# Altium schematic sheet Arduino_Mega2560.SchDoc
size A4; DocumentNumber: 1; SheetNumber: 1; SheetTotal: 4
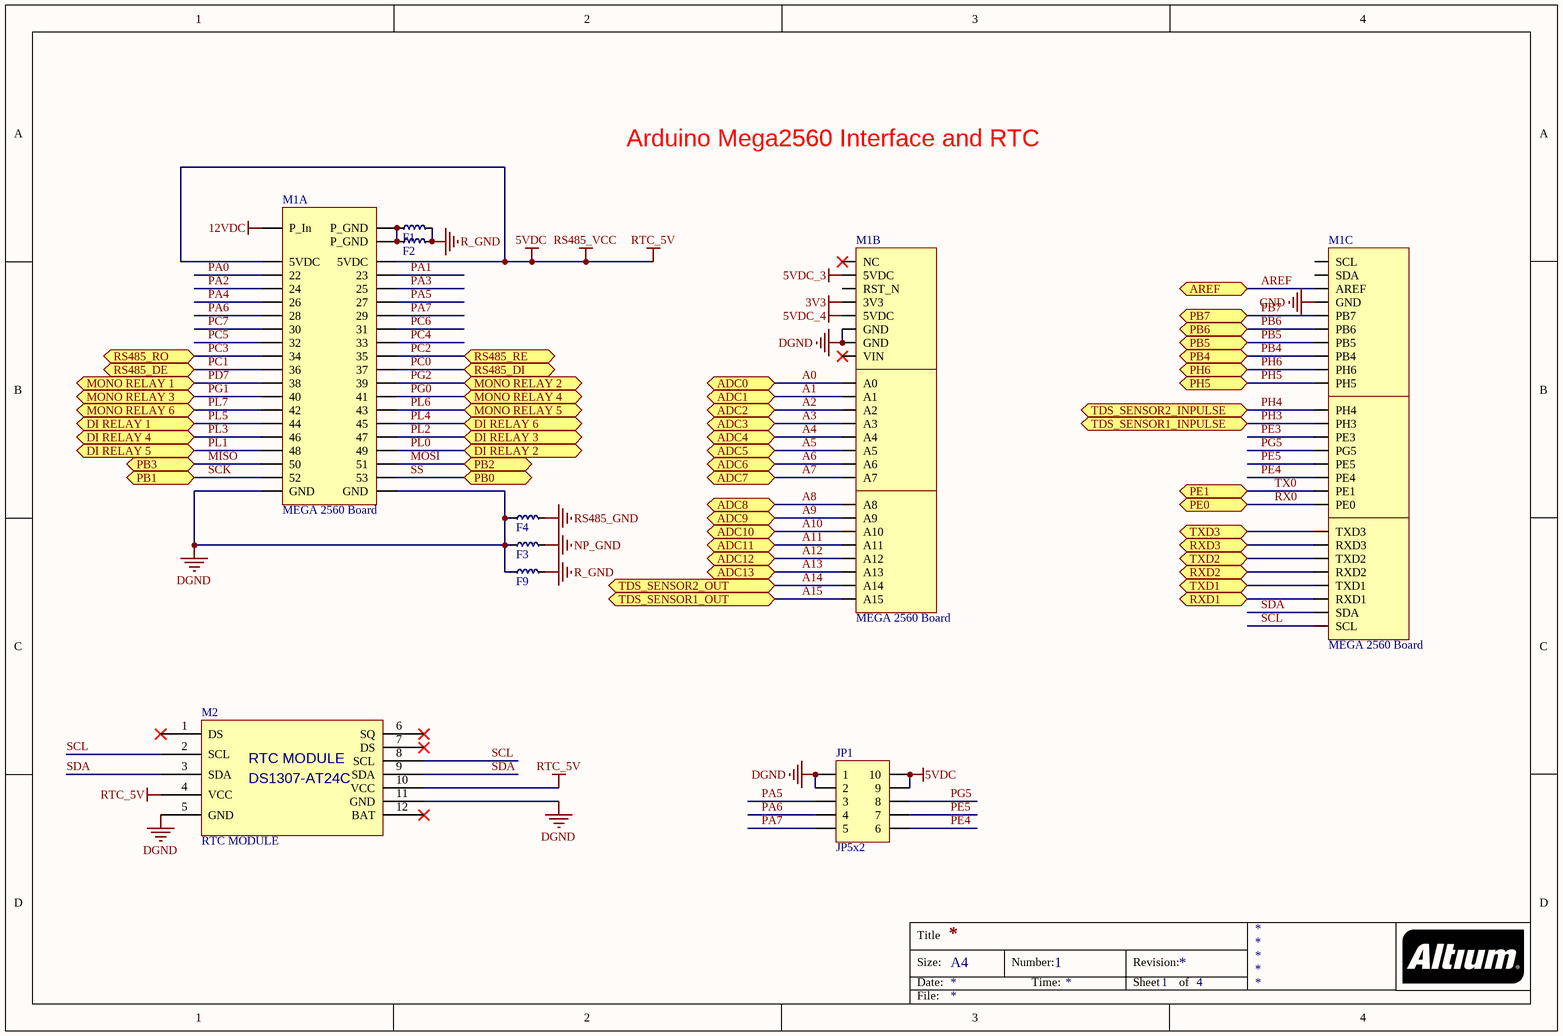
[diagram p0: Arduino_Mega2560.SchDoc]

## Parts
F1  FBFB0805  [RESC_0603]  (value not drawn)
F2  FBFB0805  [RESC_0603]  (value not drawn)
F3  FBFB0805  [RESC_0603]  (value not drawn)
F4  FBFB0805  [RESC_0603]  (value not drawn)
F9  FBFB0805  [RESC_0603]  (value not drawn)
JP1  JP5x2  [JP5-D2T]
M1  MEGA 2560 Board  [MEGA 2560]  (parts A,B,C of 3)
M2  RTC MODULE  [MODULE RTC DS1307-AT24C]

## Ports
ADC0, ADC1, ADC2, ADC3, ADC4, ADC5, ADC6, ADC7, ADC8, ADC9, ADC10, ADC11, ADC12, ADC13, AREF, DI RELAY 1, DI RELAY 2, DI RELAY 3, DI RELAY 4, DI RELAY 5, DI RELAY 6, MONO RELAY 1, MONO RELAY 2, MONO RELAY 3, MONO RELAY 4, MONO RELAY 5, MONO RELAY 6, PB0, PB1, PB2, PB3, PB4, PB5, PB6, PB7, PE0, PE1, PH5, PH6, RS485_DE, RS485_DI, RS485_RE, RS485_RO, RXD1, RXD2, RXD3, TDS_SENSOR1_INPULSE, TDS_SENSOR1_OUT, TDS_SENSOR2_INPULSE, TDS_SENSOR2_OUT, TXD1, TXD2, TXD3

## Nets
3V3: M1.3V1(3V3)
5VDC: JP1.9 JP1.10 M1.5V1(5VDC) M1.5V2(5VDC) M2.4(VCC) M2.10(VCC)  [also labelled RS485_VCC, RTC_5V]
5VDC_3: M1.5V3(5VDC)
5VDC_4: M1.5V4(5VDC)
12VDC: M1.P_In
DGND: F3.1 F4.1 F9.1 JP1.1 JP1.2 M1.G1(GND) M1.G2(GND) M1.G3(GND) M1.G4(GND) M2.5(GND) M2.11(GND)
GND: M1.G5(GND)
NP_GND: F3.2
R_GND: F1.2 F2.2 F9.2
RS485_GND: F4.2
A0: M1.A0 ; port ADC0
A1: M1.A1 ; port ADC1
A2: M1.A2 ; port ADC2
A3: M1.A3 ; port ADC3
A4: M1.A4 ; port ADC4
A5: M1.A5 ; port ADC5
A6: M1.A6 ; port ADC6
A7: M1.A7 ; port ADC7
A8: M1.A8 ; port ADC8
A9: M1.A9 ; port ADC9
A10: M1.A10 ; port ADC10
A11: M1.A11 ; port ADC11
A12: M1.A12 ; port ADC12
A13: M1.A13 ; port ADC13
A14: M1.A14 ; port TDS_SENSOR2_OUT
A15: M1.A15 ; port TDS_SENSOR1_OUT
AREF: M1.AREF ; port AREF
MISO: M1.50 ; port PB3
MOSI: M1.51 ; port PB2
PA0: M1.22
PA1: M1.23
PA2: M1.24
PA3: M1.25
PA4: M1.26
PA5: JP1.3 M1.27
PA6: JP1.4 M1.28
PA7: JP1.5 M1.29
PB4: M1.10(PB4) ; port PB4
PB5: M1.11(PB5) ; port PB5
PB6: M1.12(PB6) ; port PB6
PB7: M1.13(PB7) ; port PB7
PC0: M1.37 ; port RS485_DI
PC1: M1.36 ; port RS485_DE
PC2: M1.35 ; port RS485_RE
PC3: M1.34 ; port RS485_RO
PC4: M1.33
PC5: M1.32
PC6: M1.31
PC7: M1.30
PD7: M1.38 ; port MONO RELAY 1
PE3: M1.5(PE3)
PE4: JP1.6 M1.2(PE4)
PE5: JP1.7 M1.3(PE5)
PG0: M1.41 ; port MONO RELAY 4
PG1: M1.40 ; port MONO RELAY 3
PG2: M1.39 ; port MONO RELAY 2
PG5: JP1.8 M1.4(PG5)
PH3: M1.6(PH3) ; port TDS_SENSOR1_INPULSE
PH4: M1.7(PH4) ; port TDS_SENSOR2_INPULSE
PH5: M1.8(PH5) ; port PH5
PH6: M1.9(PH6) ; port PH6
PL0: M1.49 ; port DI RELAY 2
PL1: M1.48 ; port DI RELAY 5
PL2: M1.47 ; port DI RELAY 3
PL3: M1.46 ; port DI RELAY 4
PL4: M1.45 ; port DI RELAY 6
PL5: M1.44 ; port DI RELAY 1
PL6: M1.43 ; port MONO RELAY 5
PL7: M1.42 ; port MONO RELAY 6
RX0: M1.0(PE0) ; port PE0
RXD1: M1.19(RXD1) ; port RXD1
RXD2: M1.17(RXD2) ; port RXD2
RXD3: M1.15(RXD3) ; port RXD3
SCK: M1.52 ; port PB1
SCL: M1.21(SCL) M2.2(SCL) M2.8(SCL)
SDA: M1.20(SDA) M2.3(SDA) M2.9(SDA)
SS: M1.53 ; port PB0
TX0: M1.1(PE1) ; port PE1
TXD1: M1.18(TXD1) ; port TXD1
TXD2: M1.16(TXD2) ; port TXD2
TXD3: M1.14(TXD3) ; port TXD3
NetF1_1: F1.1 F2.1 M1.PGND1(P_GND) M1.PGND2(P_GND)

Not connected (* = marked no-connect by the designer): M1 NC* RST(RST_N) SCL SDA VIN*; M2 1(DS)* 6(SQ)* 7(DS)* 12(BAT)*

## Notes on the sheet
- Arduino Mega2560 Interface and RTC
- Title
- Size:
- Date:
- A4
- Number:
- Time:
- Revision:
- Sheet
- of
- File:
- (in symbol RTC DS1307-AR24C) DS1307-AT24C

## Library data of the parts
F1-F4 F9 = FB0603_1000Ohm: FERRITE BEAD 1000 OHM 0603; Supplier 1: Digi-Key; Supplier Part Number 1: 587-1867-1-ND
JP1 = JP5x2: WR-PHD 2.54 mm Dual Socket Header; Manufacturer: W¨¹rth Elektronik eiSos GmbH; partNo: 61301021821; ComponentLink1 Description: Manufacturer; ComponentLink2 Description: Datasheet; NoPins: 10; Created Date: 29 March 2013; ComponentLink1URL: http://www.we-online.com; ComponentLink2URL: http://katalog.we-online.de/em/datasheet/6130xx21821.pdf; Created by: Karrer Zheng
M1 = MEGA 2560 Board: Arduino ATMEGA 2560
M2 = RTC DS1307-AR24C: RTC DS1307-AT24C